# EAGLE design MAU1 (EAGLE 9.1.0)
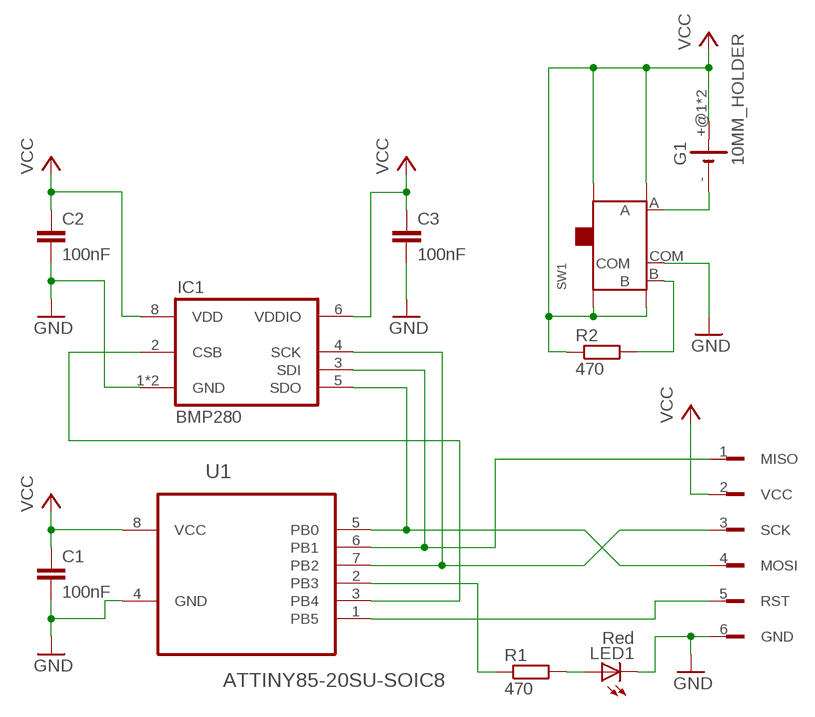
[diagram p0: schematic, sheet 1]

## Parts
C1  100nF  C-EUC0603K  [C0603K]
C2  100nF  C-EUC0603K  [C0603K]
C3  100nF  C-EUC0603K  [C0603K]
G1  10MM_HOLDER  [10MM_HOLDER]
IC1  BMP280  [BMP280]
LED1  Red  LEDKA-3528ASYC  [KA-3528ASYC]
R1  470  R-EU_R0603  [R0603]
R2  470  R-EU_R0603  [R0603]
SW1  SMD-TOGGLE-SWITCH-ON-ON(3+4P-6.7X2.7MM)SLIDE_LATERAL  [SW7-SMD-6.7X2.6X1.4MM-90D]
U1  ATTINY85-20SU-SOIC8  MCU-ATTINY85-20SU(SOIC8)  [SOIC8-1.27-5.3X5.3MM]
U$1  ISP_CONN_6_FDRILL16  [ISP_CONN_6_F_DRILL16]

## Nets
GND: C1.2 C2.2 C3.2 IC1.1(GND) IC1.7(GND) LED1.C SW1.COM U1.4(GND) U$1.6(GND)
N$1: G1.- SW1.A
N$2: R1.1 U1.2(PB3)
N$3: U1.1(PB5) U$1.5(RST)
N$4: LED1.A R1.2
N$5: IC1.2(CSB) U1.3(PB4)
N$6: R2.2 SW1.B
N$7: IC1.4(SCK) U1.7(PB2) U$1.3(SCK)
N$8: IC1.3(SDI) U1.6(PB1) U$1.1(MISO)
N$9: IC1.5(SDO) U1.5(PB0) U$1.4(MOSI)
VCC: C1.1 C2.1 C3.1 G1.+@1(+) G1.+@2(+) IC1.6(VDDIO) IC1.8(VDD) R2.1 SW1.P1(SS4) SW1.P2(SS3) SW1.P3(SS2) SW1.P4(SS1) U1.8(VCC) U$1.2(VCC)

## Library data of the parts
C1-C3 = rcl:C-EU: CAPACITOR, European symbol
G1 = battery:10MM_HOLDER: Battery cell clip for CR927 Source: KEYSTONE ELECTRONICS CORP. www.keyelco.com, ASTORIA, N.Y. 11105-2017 PART ANME 10mm SM COIN CELl CLIP DWG NO. 3030
IC1 = bosch-bmp280:BMP280: The BMP280 is an absolute barometric pressure sensor especially designed for mobile applications. The sensor module is housed in an extremely compact 8-pin metal-lid LGA package with a footprint of only 2.0 × 2.5 mm2 and 0.95 mm package height. Its small dimensions and its low power consumption of 2.7 μA @1Hz allow the implementation in battery driven devices such as mobile phones, GPS modules or watches. The library has been designed by Richard Magdycz <https://www.facebook.com/groups/eaglecadsoftUK>
LED1 = led:LED: LED OSRAM: - CHIPLED LG R971, LG N971, LY N971, LG Q971, LY Q971, LO R971, LY R971 LH N974, LH R974 LS Q976, LO Q976, LY Q976 LO Q996 - Hyper CHIPLED LW Q18S LB Q993, LB Q99A, LB R99A - SideLED LS A670, LO A670, LY A670, LG A670, LP A670 LB A673, LV A673, LT A673, LW A673 LH A674 LY A675 LS A676, LA A676, LO A676, LY A676, LW A676 LS A679, LY A679, LG A679 - Hyper Micro SIDELED® LS Y876, LA Y876, LO Y876, LY Y876 LT Y87S - SmartLED LW L88C, LW L88S LB L89C, LB L89S, LG L890 LS L89K, LO L89K, LY L89K LS L896, LA L896, LO L896, LY L896 - TOPLED LS T670, LO T670, LY T670, LG T670, LP T670 LSG T670, LSP T670, LSY T670, LOP T670, LYG T670 LG T671, LOG T671, LSG T671 LB T673, LV T673, LT T673, LW T673 LH T674 LS T676, LA T676, LO T676, LY T676, LB T676, LH T676, LSB T676, LW T676 LB T67C, LV T67C, LT T67C, LS T67K, LO T67K, LY T67K, LW E67C LS E67B, LA E67B, LO E67B, LY E67B, LB E67C, LV E67C, LT E67C LW T67C LS T679, LY T679, LG T679 LS T770, LO T770, LY T770, LG T770, LP T770 LB T773, LV T773, LT T773, LW T773 LH T774 LS E675, LA E675, LY E675, LS T675 LS T776, LA T776, LO T776, LY T776, LB T776 LHGB T686 LT T68C, LB T68C - Hyper Mini TOPLED® LB M676 - Mini TOPLED Santana® LG M470 LS M47K, LO M47K, LY M47K Source: http://www.osram.convergy.de LUXEON: - LUMILED® LXK2-PW12-R00, LXK2-PW12-S00, LXK2-PW14-U00, LXK2-PW14-V00 LXK2-PM12-R00, LXK2-PM12-S00, LXK2-PM14-U00 LXK2-PE12-Q00, LXK2-PE12-R00, LXK2-PE12-S00, LXK2-PE14-T00, LXK2-PE14-U00 LXK2-PB12-K00, LXK2-PB12-L00, LXK2-PB12-M00, LXK2-PB14-N00, LXK2-PB14-P00, LXK2-PB14-Q00 LXK2-PR12-L00, LXK2-PR12-M00, LXK2-PR14-Q00, LXK2-PR14-R00 LXK2-PD12-Q00, LXK2-PD12-R00, LXK2-PD12-S00 LXK2-PH12-R00, LXK2-PH12-S00 LXK2-PL12-P00, LXK2-PL12-Q00, LXK2-PL12-R00 Source: www.luxeon.com KINGBRIGHT: KA-3528ASYC Source: www.kingbright.com
R1 R2 = rcl:R-EU_: RESISTOR, European symbol
SW1 = altimeter:SMD-TOGGLE-SWITCH-ON-ON(3+4P-6.7X2.7MM): 311030001
U1 = Seeed-OPL-ic:MCU-ATTINY85-20SU(SOIC8): 310010108; MPN: ATTINY85-20SU
U$1 = altimeter:ISP_CONN_6_F

## Board
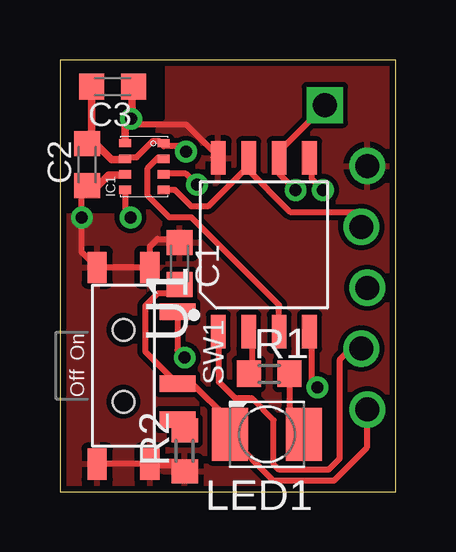
[diagram p1: board, top side]
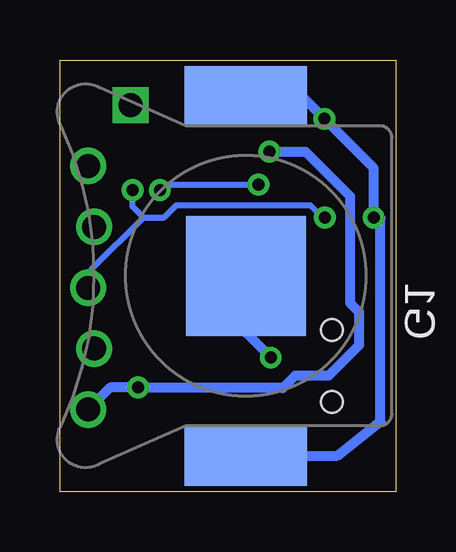
[diagram p2: board, bottom side, seen from below]

Size 14 x 18 mm. Coordinates in mm from the lower left corner, seen from the top.
Outline: 0,0 14,0 14,18 0,18 0,0
Copper layers (1*16): Top 0.035mm / dielectric 1.5mm / Bottom 0.035mm
Design rules "default *": minimum track width 10mil, minimum drill 0.5mm, track to track 8mil, track to pad 8mil, pad to pad 8mil, via to via 8mil, smd to smd 8mil, copper to edge 10mil, drill to drill 8mil, minimum pad ring 10mil, minimum via ring 8mil, stop-mask expansion 4mil, vias tented up to drill 0mil, thermal gap 10mil

### Footprints (pad centres in the part's own frame; a part is rotated, then mirrored left to right if it is on the bottom)
C0603K = smd 1.05 x 1.08: 1 -0.875,0; 2 0.875,0
10MM_HOLDER = smd 2.5 x 5.1 bottom: +@1 -7.5,0; +@2 7.5,0 | smd 5 x 5 bottom: - 0,0
BMP280 = smd 0.35 x 0.5: 1 0.975,-0.8; 2 0.325,-0.8; 3 -0.325,-0.8; 4 -0.975,-0.8; 5 -0.975,0.8; 6 -0.325,0.8; 7 0.325,0.8; 8 0.975,0.8
KA-3528ASYC = smd 1.5 x 2.2: A -1.55,0; C 1.55,0
R0603 = smd 1 x 1.1: 1 -0.85,0; 2 0.85,0
SW7-SMD-6.7X2.6X1.4MM-90D = smd 0.7 x 1.5: A -2.25,2.25; B 2.25,2.25; COM 0.75,2.25 | smd 1.3 x 0.8: P1 -4.1,1.1; P2 -4.1,-1.1; P3 4.1,-1.1; P4 4.1,1.1 | hole 0.9: -1.5,0; 1.5,0
SOIC8-1.27-5.3X5.3MM = smd 0.62 x 1.4: 1 -1.905,-3.623; 2 -0.635,-3.623; 3 0.635,-3.623; 4 1.905,-3.623; 5 1.905,3.623; 6 0.635,3.623; 7 -0.635,3.623; 8 -1.905,3.623
ISP_CONN_6_F_DRILL16 = drill 1 square: 1 -1.778,7.62 | drill 1: 2 0,5.08; 3 -0.254,2.54; 4 0,0; 5 -0.254,-2.54; 6 0,-5.08

### Placement (x,y rotation side)
C1  4.98,9.51 270 top
C2  1.13,13.64 90 top
C3  2.19,16.89 180 top
G1  6.25,9 90 top
IC1  3.52,13.55 90 top
LED1  8.64,2.39 180 top
R1  8.73,4.91 0 top
R2  5.2,1.7 90 top
SW1  2.65,5.25 270 top
U1  8.51,10.29 0 top
U$1  12.83,8.5 0 top

### Tracks (layer width: path | path; a pad name or v marks a point on that pad's centre or on a via)
GND  (via drill 0.5)
  Top 0.254: IC1.7 2.74,13.95 3.2,13.95 3.89,14.63 4.12,14.63 IC1.1 4.34,14.4 5.03,14.4 v5.26,14.17 | v10.74,4.34 10.52,4.57 10.52,6.63 U1.4 | U$1.6 12.8,3.39 12.8,1.83 11.43,0.46 8.91,0.46 7.09,2.29 LED1.C 6.99,2.49 6.99,3.05 5.53,4.5 SW1.COM 3.56,5.84 3.56,7.75 4.06,8.26 4.6,8.26 C1.2
  Top 0.305: IC1.7 2.68,13.84 2.16,13.84 1.49,14.52 C2.2 1.32,14.7 C3.2
  Bottom 0.406: v5.26,14.17 3.76,14.17 1.91,12.32 1.91,7.87 1.52,7.49 1.52,6.1 2.79,4.83 4.19,4.83 4.7,4.32 10.72,4.32 v10.74,4.34 11.9,4.34 U$1.6
N$1  (via drill 0.5)
  Top 0.254: SW1.A 4.9,5.89 v5.21,5.59
  Bottom 0.254: 6.25,6.63 G1.-
  Bottom 0.406: v5.21,5.59 6.25,6.63
N$2
  Top 0.254: R1.1 8,5.03 8,6.63 U1.2
N$3
  Top 0.254: U1.1 6.63,6.63 6.63,4.57 7.32,3.89 8,3.89 8.91,2.97 8.91,1.14 9.14,0.91 11.2,0.91 11.66,1.37 11.66,5.49 12.13,5.96 U$1.5
N$4
  Top 0.254: R1.2 9.6,4.8 9.6,2.97 10.06,2.52 LED1.A
N$5
  Top 0.254: U1.3 9.14,7.77 5.49,11.43 4.57,11.43 3.66,12.34 3.66,13.49 4.12,13.95 IC1.2
N$6
  Top 0.254: R2.2 5.2,2.7 SW1.B
N$7
  Top 0.254: 7.77,13.49 8,13.72 U1.7 7.77,13.49 | 7.77,13.49 6.17,11.89 5.49,11.89 4.8,12.57 4.34,12.57 IC1.4 | 7.77,13.49 9.6,11.66 12.57,11.66 U$1.3
N$8  (via drill 0.5)
  Top 0.254: v5.71,12.8 5.26,13.26 4.34,13.26 IC1.3 | v9.83,12.57 9.14,13.26 U1.6 9.14,14.17 10.97,16 11.01,16.08 U$1.1
  Bottom 0.254: v5.71,12.8 9.6,12.8 v9.83,12.57
N$9  (via drill 0.5)
  Top 0.254: v2.95,11.43 2.74,11.63 2.74,12.57 IC1.5 | v10.97,12.57 10.52,13.03 10.52,13.72 U1.5
  Bottom 0.254: 10.52,11.43 9.65,11.43 9.14,11.94 3.56,11.94 3.05,11.43 v2.95,11.43 | 10.52,11.43 12.7,9.25 U$1.4 | v10.97,12.57 10.97,11.89 10.52,11.43
VCC  (via drill 0.5)
  Top 0.254: U1.8 6.4,13.95 6.4,14.17 5.26,15.32 2.97,15.32 2.89,15.39 | v2.97,15.54 3,15.5 | C2.1 0.91,12.57 v0.91,11.43 0.91,9.99 SW1.P2 SW1.P1 3.75,10.23 4.06,10.54 4.83,10.54 C1.1 | SW1.P4 SW1.P3 | R2.1 4.9,1.15
  Top 0.305: C2.1 1.59,12.77 2.03,13.21 2.69,13.21 IC1.6 | IC1.8 2.72,15.22 2.89,15.39 3,15.5 3,16.82 C3.1
  Top 0.406: 4.9,1.15 SW1.P4
  Bottom 0.254: 5.94,16.46 G1.+@2
  Bottom 0.406: G1.+@1 2.44,1.5 0.64,2.92 0.64,11.4 v0.91,11.43 0.91,13.49 v2.97,15.54 3.89,16.46 5.94,16.46
  pour Top: 0,0 0,11.5 3,11.5 3.5,12 3.5,14.5 4.5,15.5 4.5,18 14,18 14,0

### Text on the board
tPlace: On | Off